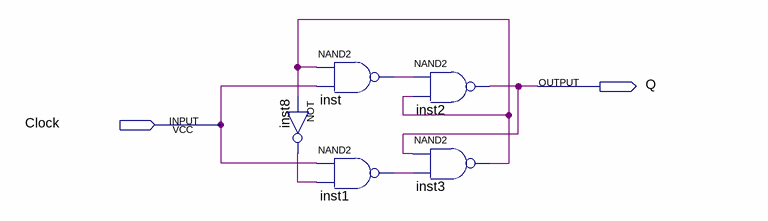
[diagram p0: schematic sheet]
// Quartus schematic FrequencyDivider.bdf as structural Verilog: 5 symbols, 2 pins
module FrequencyDivider (
  input  Clock,
  output Q
);

  wire inst1_out, inst3_out, inst8_out, inst_out;

  nand inst (inst_out, inst3_out, Clock);
  not inst8 (inst8_out, inst3_out);
  nand inst1 (inst1_out, Clock, inst8_out);
  nand inst2 (Q, inst_out, inst3_out);
  nand inst3 (inst3_out, Q, inst1_out);
endmodule
